# Altium schematic sheet Keyboard_SYS.SchDoc
size A4
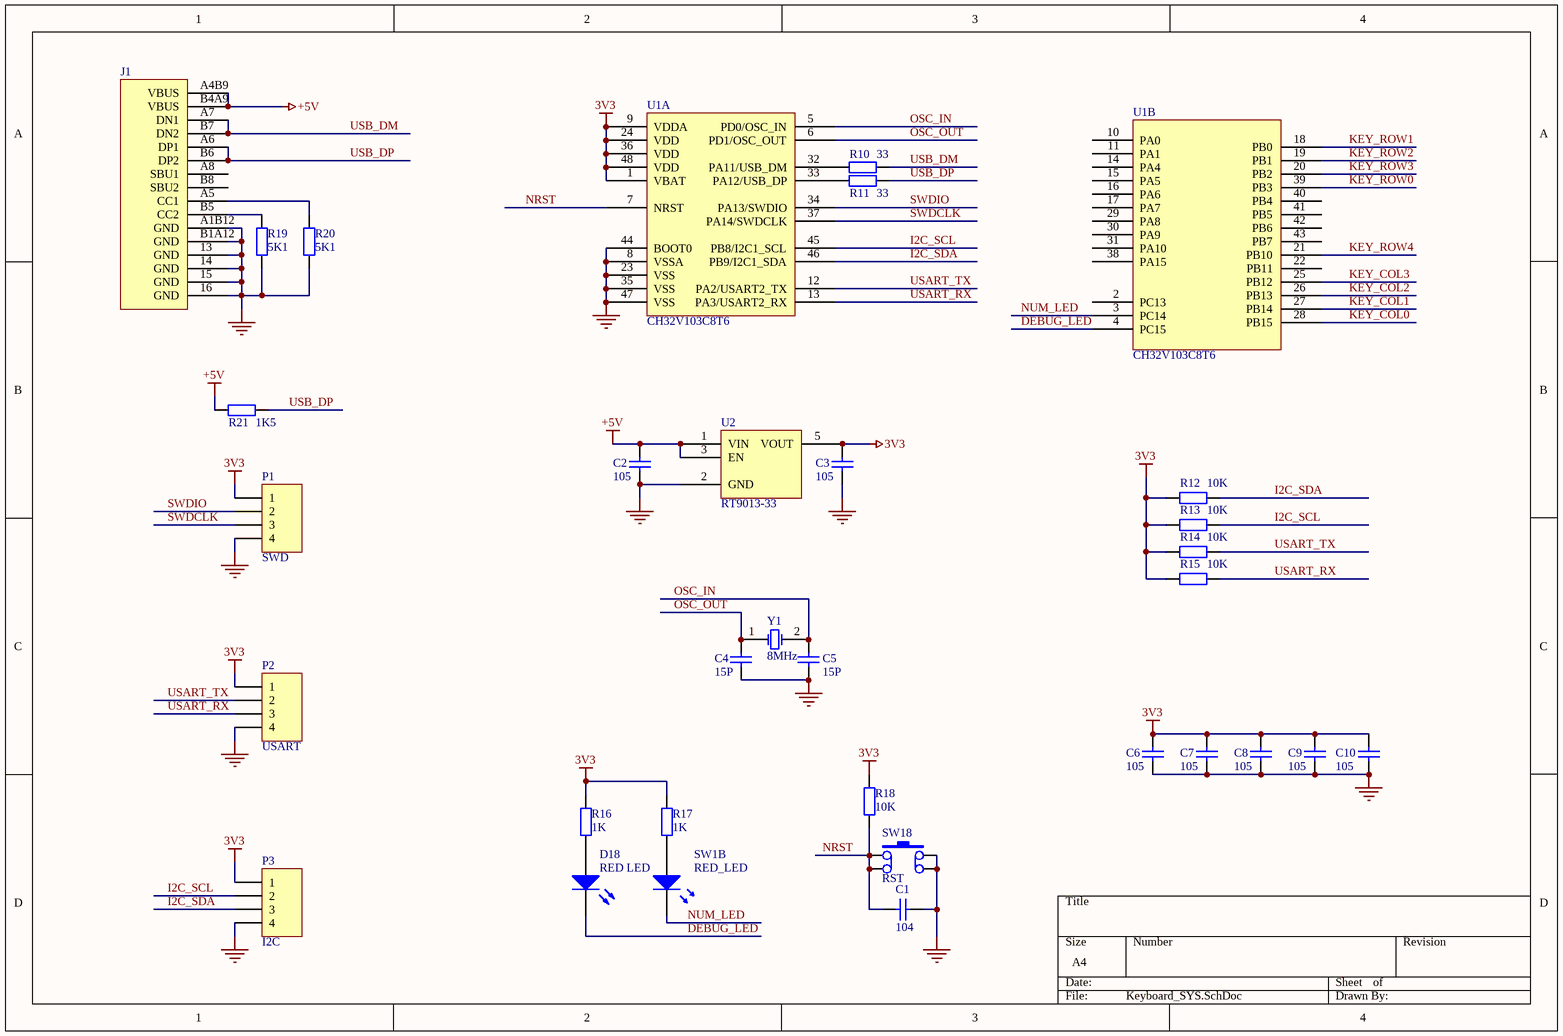
[diagram p0: Keyboard_SYS.SchDoc]

## Parts
C1  104  [C0603]
C2  105  [C0603]
C3  105  [C0603]
C4  15P  [C0603]
C5  15P  [C0603]
C6  105  [C0603]
C7  105  [C0603]
C8  105  [C0603]
C9  105  [C0603]
C10  105  [C0603]
D18  RED LED  [LED0603-RED]
J1  TYPEC-304S-ACP16  [USB-C-SMD_TYPEC-304-BCP16]  (value not drawn)
P1  SWD  [SIP4]
P2  USART  [SIP4]
P3  I2C  [SIP4]
R10  33  [R0603]
R11  33  [R0603]
R12  10K  [R0603]
R13  10K  [R0603]
R14  10K  [R0603]
R15  10K  [R0603]
R16  1K  [R0603]
R17  1K  [R0603]
R18  10K  [R0603]
R19  5K1  [R0603]
R20  5K1  [R0603]
R21  1K5  [R0603]
SW1  RED_LED  [MX_SW-4-1206LED]  (part B of 2)
SW18  RST  [Push Buttom SMD]
U1  CH32V103C8T6  [PQFP48]  (parts A,B of 2)
U2  RT9013-33  [SOT-23-5]
Y1  8MHz  [CY5032]

## Nets
3V3: C3.2 C6.2 C7.2 C8.2 C9.2 C10.2 P1.1 P2.1 P3.1 R12.2 R13.2 R14.2 R15.2 R16.2 R17.2 R18.1 U1.1(VBAT) U1.9(VDDA) U1.24(VDD) U1.36(VDD) U1.48(VDD) U2.5(VOUT)
+5V: C2.2 J1.A4B9(VBUS) J1.B4A9(VBUS) R21.1 U2.1(VIN) U2.3(EN)
GND: C1.1 C2.1 C3.1 C4.1 C5.1 C6.1 C7.1 C8.1 C9.1 C10.1 J1.13(GND) J1.14(GND) J1.15(GND) J1.16(GND) J1.A1B12(GND) J1.B1A12(GND) P1.4 P2.4 P3.4 R19.2 R20.2 SW18.3 SW18.4 U1.8(VSSA) U1.23(VSS) U1.35(VSS) U1.44(BOOT0) U1.47(VSS) U2.2(GND)
DEBUG_LED: D18.2(K) U1.4(PC15)
I2C_SCL: P3.2 R13.1 U1.45(PB8/I2C1_SCL)
I2C_SDA: P3.3 R12.1 U1.46(PB9/I2C1_SDA)
KEY_COL0: U1.28(PB15)
KEY_COL1: U1.27(PB14)
KEY_COL2: U1.26(PB13)
KEY_COL3: U1.25(PB12)
KEY_ROW0: U1.39(PB3)
KEY_ROW1: U1.18(PB0)
KEY_ROW2: U1.19(PB1)
KEY_ROW3: U1.20(PB2)
KEY_ROW4: U1.21(PB10)
NRST: C1.2 R18.2 SW18.1 SW18.2 U1.7(NRST)
NUM_LED: SW1.4 U1.3(PC14)
OSC_IN: C5.2 U1.5(PD0/OSC_IN) Y1.2(OSC2)
OSC_OUT: C4.2 U1.6(PD1/OSC_OUT) Y1.1(OSC1)
SWDCLK: P1.3 U1.37(PA14/SWDCLK)
SWDIO: P1.2 U1.34(PA13/SWDIO)
USART_RX: P2.3 R15.1 U1.13(PA3/USART2_RX)
USART_TX: P2.2 R14.1 U1.12(PA2/USART2_TX)
USB_DM: J1.A7(DN1) J1.B7(DN2) R10.2
USB_DP: J1.A6(DP1) J1.B6(DP2) R11.2 R21.2
NetD18_1: D18.1(A) R16.1
NetJ1_A5: J1.A5(CC1) R20.1
NetJ1_B5: J1.B5(CC2) R19.1
NetR10_1: R10.1 U1.32(PA11/USB_DM)
NetR11_1: R11.1 U1.33(PA12/USB_DP)
NetR17_1: R17.1 SW1.3

Not connected (* = marked no-connect by the designer): J1 A8(SBU1) B8(SBU2); U1 2(PC13) 10(PA0) 11(PA1) 14(PA4) 15(PA5) 16(PA6) 17(PA7) 22(PB11) 29(PA8) 30(PA9) 31(PA10) 38(PA15) 40(PB4) 41(PB5) 42(PB6) 43(PB7); U2 4(NC)

## Library data of the parts
C1 = Cap Semi: Capacitor (Semiconductor SIM Model); Published: 8-Jun-2000; LatestRevisionDate: 29-May-2009; LatestRevisionNote: IPC-7351 Footprint Added.; PackageReference: C1206; Publisher: Altium Limited; PackageDescription: Chip Capacitor; Value: 104
C2-C10 = Cap Semi: Capacitor (Semiconductor SIM Model); Value: 104; Published: 8-Jun-2000; LatestRevisionDate: 29-May-2009; LatestRevisionNote: IPC-7351 Footprint Added.; PackageReference: C1206; Publisher: Altium Limited; PackageDescription: Chip Capacitor
D18 = LED2: Typical RED, GREEN, YELLOW, AMBER GaAs LED; Published: 8-Jun-2000; LatestRevisionDate: 17-Jul-2002; LatestRevisionNote: Re-released for DXP Platform.; PackageVersion: Feb-2002; PackageReference: 3.2X1.6X1.1; Publisher: Altium Limited; PackageDescription: SM LED; 2 Flat Leads
P1-P3 = Header 4: Header, 4-Pin; LatestRevisionDate: 17-Jul-2002; LatestRevisionNote: Re-released for DXP Platform.; Publisher: Altium Limited
R10-R15 R18-R21 = Res2: Resistor; Value: 1K; Published: 8-Jun-2000; LatestRevisionDate: 17-Jul-2002; LatestRevisionNote: Re-released for DXP Platform.; PackageReference: AXIAL-0.4; Publisher: Altium Limited; PackageDescription: Axial Device, Thru-Hole; 2 Leads; 0.4 in Pin Spacing
R16 R17 = Res2: Resistor; Published: 8-Jun-2000; LatestRevisionDate: 17-Jul-2002; LatestRevisionNote: Re-released for DXP Platform.; PackageReference: AXIAL-0.4; Publisher: Altium Limited; PackageDescription: Axial Device, Thru-Hole; 2 Leads; 0.4 in Pin Spacing; Value: 1K
SW1 = MX_SW-4-1206LED
SW18 = Push Buttom
U1 = STM32F103C8Tx: STM32F103C8Tx series arm mcu
U2 = RT9013-33: RT9013 3.3V  LDO Regulator
Y1 = XTAL: Crystal Oscillator; Published: 8-Jun-2000; LatestRevisionDate: 17-Jul-2002; LatestRevisionNote: Re-released for DXP Platform.; PackageReference: R38; Publisher: Altium Limited; PackageDescription: Crystal, Thru-Hole; 2 Leads; Body 3.1 x 8.2 mm (Dia.xH)